# EasyEDA schematic Astable multivibrator_2021-06-05.json
TITLE: Astable multivibrator; REV: 1.0; Date: 2021-06-04; Sheet: 1/1; Drawn By: Ferrie Bank; Company: github.com/oudesnepelaar
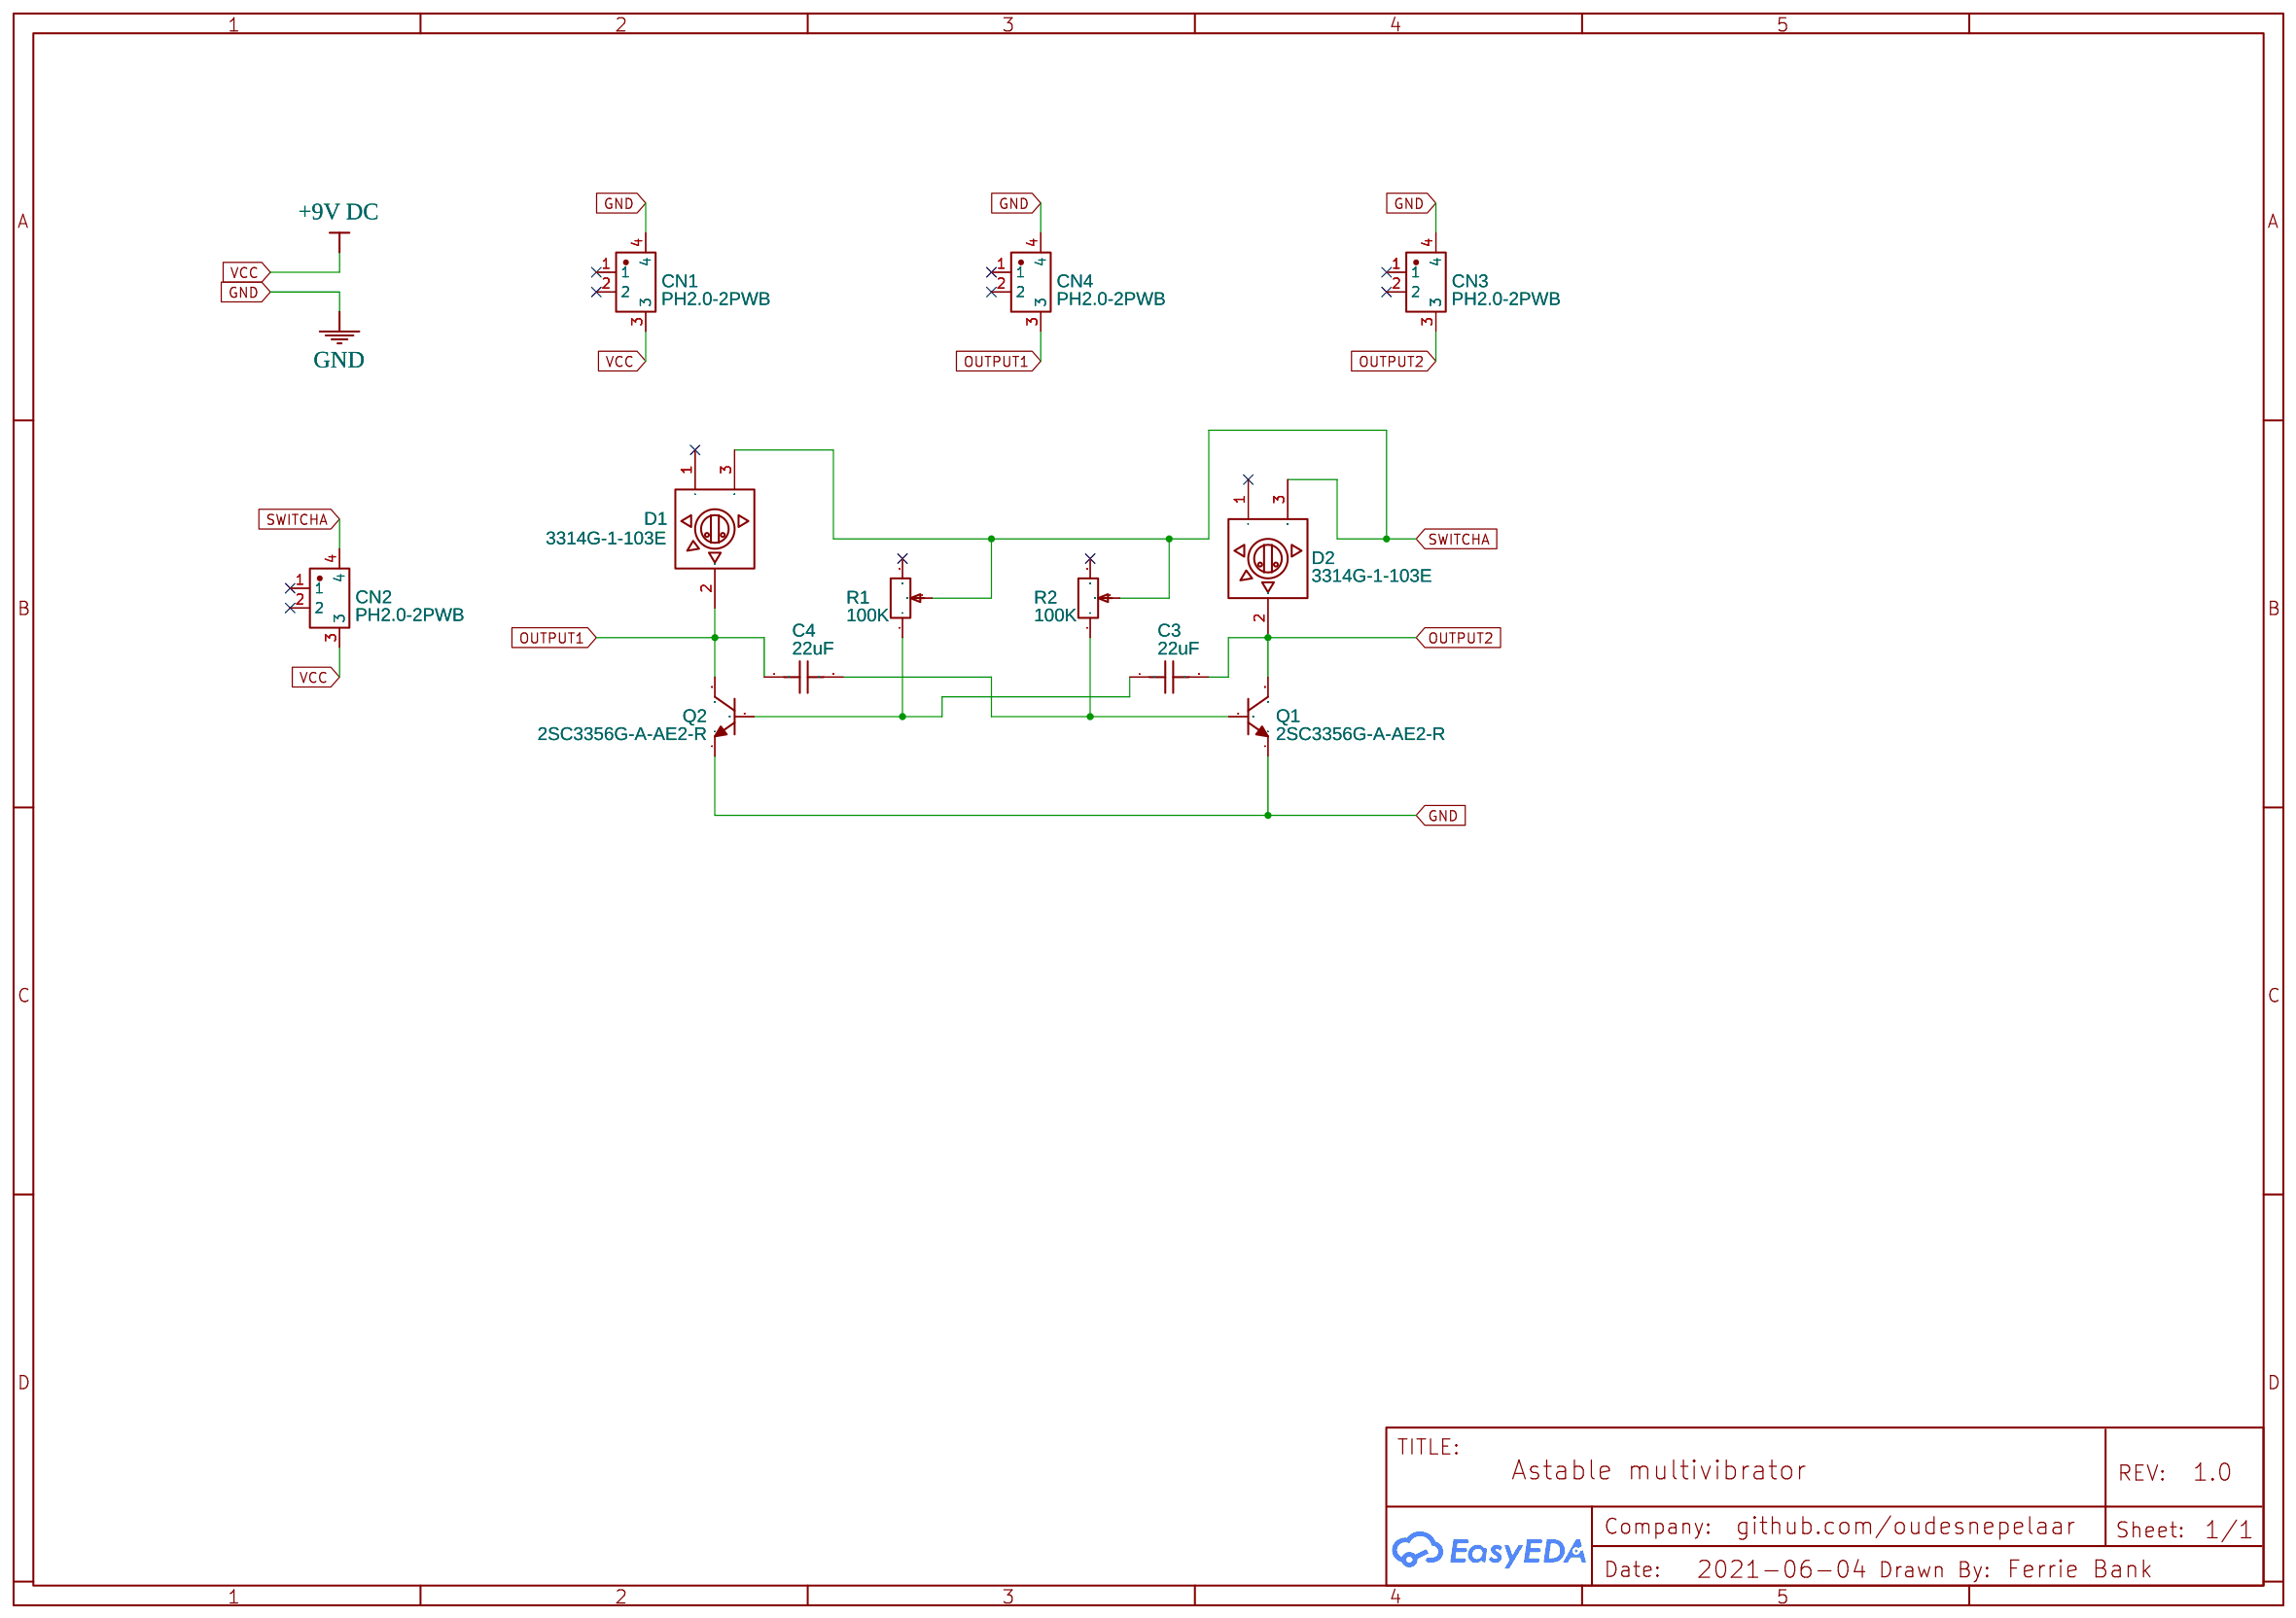
[diagram p0: schematic sheet]

## Parts
C3  22uF  [C0805]
C4  22uF  [C0805]
CN1  PH2.0-2PWB  [CONN-SMD_2P-P2.00_PH2.0-SPWB]
CN2  PH2.0-2PWB  [CONN-SMD_2P-P2.00_PH2.0-SPWB]
CN3  PH2.0-2PWB  [CONN-SMD_2P-P2.00_PH2.0-SPWB]
CN4  PH2.0-2PWB  [CONN-SMD_2P-P2.00_PH2.0-SPWB]
D1  3314G-1-103E  [RES-ADJ-SMD_3314G-1-103E]
D2  3314G-1-103E  [RES-ADJ-SMD_3314G-1-103E]
Q1  2SC3356G-A-AE2-R  [SOT-23-3_L2.9-W1.6-P1.90-LS2.8-TR-CW]
Q2  2SC3356G-A-AE2-R  [SOT-23-3_L2.9-W1.6-P1.90-LS2.8-TR-CW]
R1  100K  [RES-ADJ-SMD_3P-L4.5-W4.5-P2.30-BL-FS]
R2  100K  [RES-ADJ-SMD_3P-L4.5-W4.5-P2.30-BL-FS]

## Library data of the parts
C3 C4 = GRM21BC81C226ME44L: Supplier: LCSC; Supplier Part: C258782; Manufacturer: Murata Electronics; Contributor: LCSC; JLCPCB Part Class: Extended Part
CN1-CN4 = PH2.0-2PWB: Supplier: LCSC; Manufacturer: BOOMELE; Manufacturer Part: PH2.0-2PWB Horizontal; Supplier Part: C47647; JLCPCB Part Class: Extended Part
D1 D2 = 3314G-1-103E: Supplier: LCSC; Supplier Part: C780220; Manufacturer: BOURNS; Contributor: LCSC; JLCPCB Part Class: Extended Part
Q1 Q2 = 2SC3356G-A-AE2-R: Supplier: LCSC; Manufacturer: UTC; Contributor: LCSC; Supplier Part: C171546; JLCPCB Part Class: Extended Part
R1 R2 = 3314J-1-104E: Supplier: LCSC; Manufacturer: BOURNS; Supplier Part: C51284; JLCPCB Part Class: Extended Part

## Nets
+9V DC: CN1.3 CN2.3
GND: CN1.4 CN3.4 CN4.4 Q1.1(E) Q2.1(E)
OUTPUT1: C4.1 CN4.3 D1.2 Q2.3(C)
OUTPUT2: C3.2 CN3.3 D2.2 Q1.3(C)
SWITCHA: CN2.4 D1.3 D2.3 R1.2 R2.2
Net-(C3-1): C3.1 Q2.2(B) R1.1
Net-(C4-2): C4.2 Q1.2(B) R2.1

Not connected (* = marked no-connect by the designer): CN1 1* 2*; CN2 1* 2*; CN3 1* 2*; CN4 1* 2*; D1 1*; D2 1*; R1 3*; R2 3*
